# Altium project ((Inventory)).PrjPcb (part 4 of 4)

## Sheet Connector.SchDoc
size A3; SheetNumber: 16; SheetTotal: 26
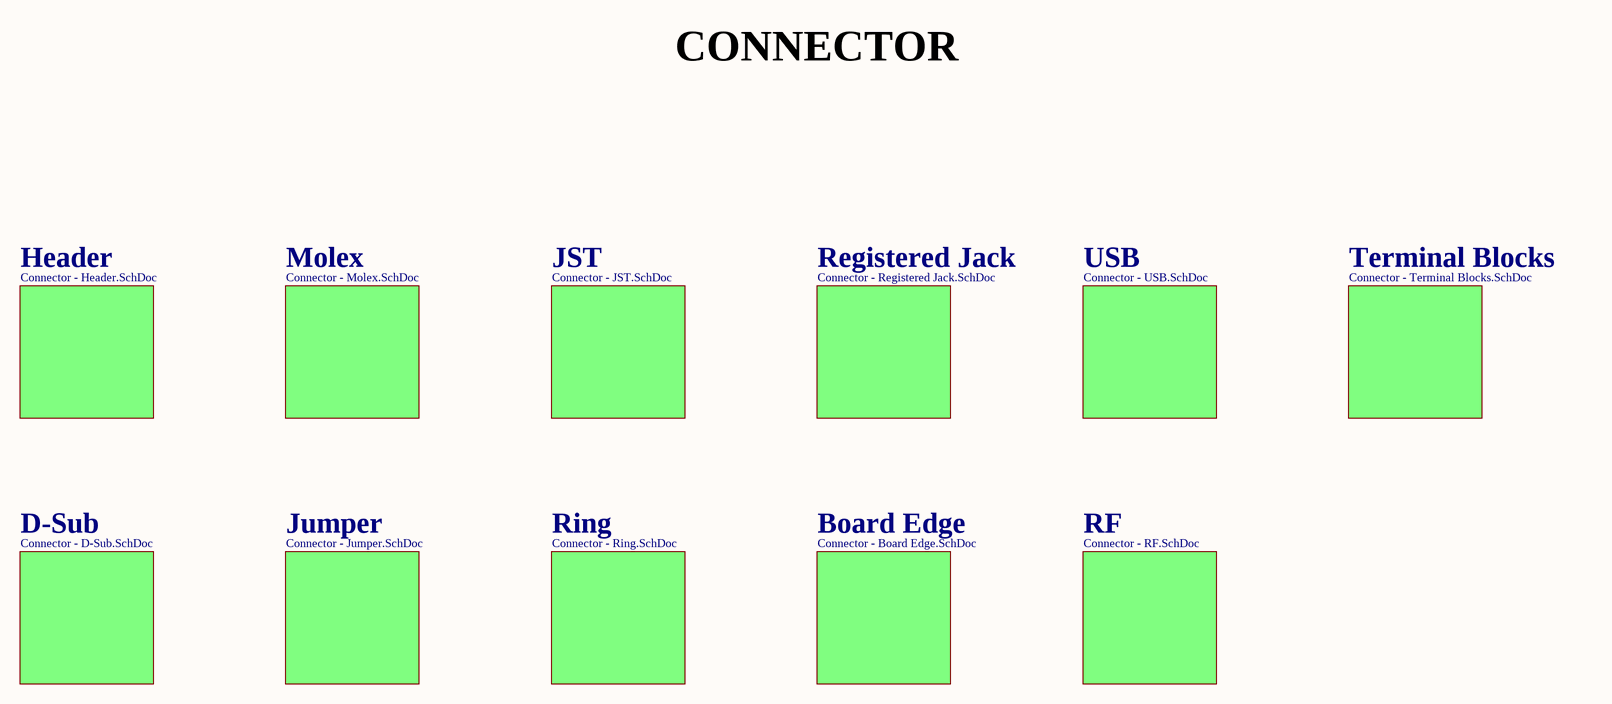
[diagram p64: Connector.SchDoc]

### Sub-sheets
Board Edge = Connector - Board Edge.SchDoc (file not in this document): no entries
D-Sub = Connector - D-Sub.SchDoc (file not in this document): no entries
Header = Connector - Header.SchDoc: no entries
JST = Connector - JST.SchDoc: no entries
Jumper = Connector - Jumper.SchDoc (file not in this document): no entries
Molex = Connector - Molex.SchDoc (file not in this document): no entries
Registered Jack = Connector - Registered Jack.SchDoc: no entries
RF = Connector - RF.SchDoc (file not in this document): no entries
Ring = Connector - Ring.SchDoc (file not in this document): no entries
Terminal Blocks = Connector - Terminal Blocks.SchDoc (file not in this document): no entries
USB = Connector - USB.SchDoc: no entries

### Notes on the sheet
- CONNECTOR

## Sheet Connector - Header.SchDoc
size A4; SheetNumber: 17; SheetTotal: 28
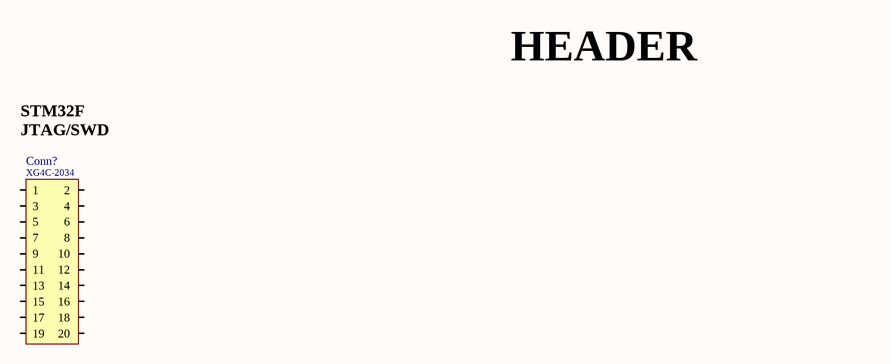
[diagram p65: Connector - Header.SchDoc]

### Parts
(Parts that share a designator on the sheet are numbered #1, #2 ... from top to bottom, then left to right.)
Conn?#1  Manufacturer Part Number: XG4C-2034  [Connector - Omron, XG4C-2034]  (hidden comment: Connector - 20P)

### Nets

Not connected (* = marked no-connect by the designer): Conn?#1 1 2 3 4 5 6 7 8 9 10 11 12 13 14 15 16 17 18 19 20

### Notes on the sheet
- HEADER
- (near Conn?#1) STM32F
  JTAG/SWD

### Library data of the parts
Conn?#1 = Connector - 20P: Conn, Header, 20P, RA, TH, Shrouded; Manufacturer: Omron; ComponentLink1Description: Datasheet; ComponentLink1URL: E:\Altium\Datasheets\Connector - Header\Connector - Omron, XG4 Series.pdf; ComponentLink2Description: Supplier Link; ComponentLink2URL: https://www.digikey.com/en/products/detail/omron-electronics-inc-emc-div/XG4C-2034/1787182; Supplier: Digikey; Supplier Part Number: OR900-ND; Operating Temperature, Min: -55℃; Operating Temperature, Max: +105℃; Quantity, Min: 1; Quantity, Max: 450; Price, Min: 1.97; Supplier Currency: $; Price, Max: 1.27716; Supplier Link: https://www.digikey.com/en/products/detail/omron-electronics-inc-emc-div/XG4C-2034/1787182; Component Type: Header; Component Category: Connector; Package: TH, RA, Shrouded

## Sheet Connector - JST.SchDoc
size A3; SheetNumber: 18; SheetTotal: 41
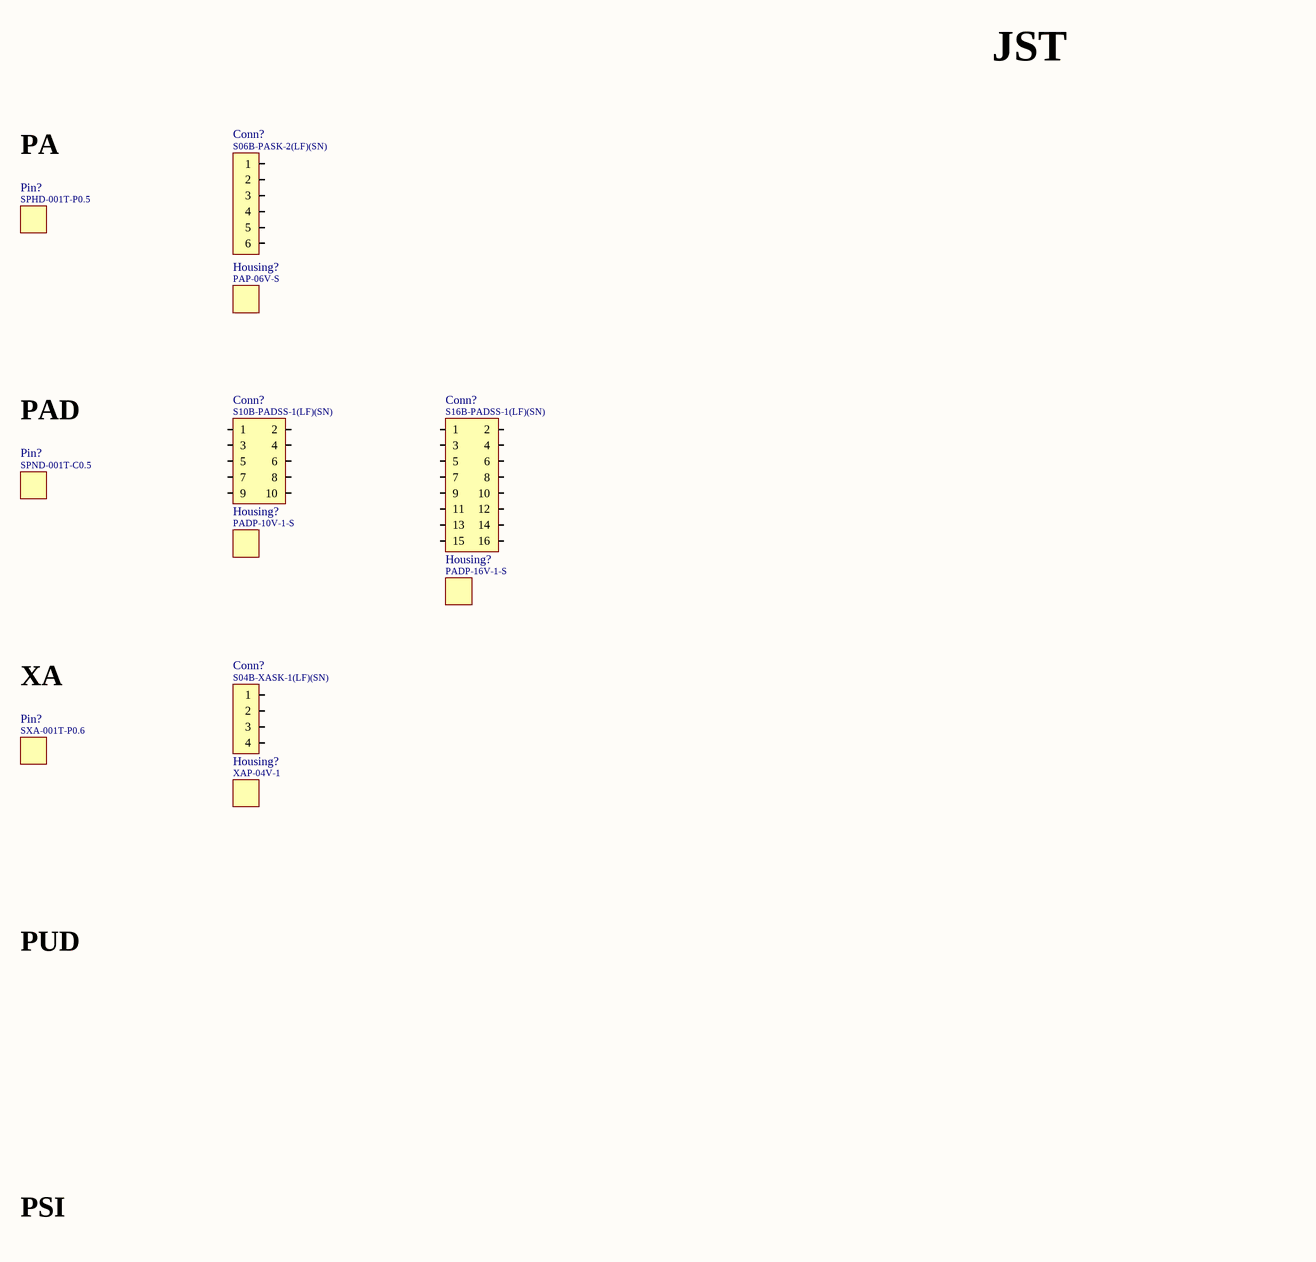
[diagram p66: Connector - JST.SchDoc]

### Parts
(Parts that share a designator on the sheet are numbered #1, #2 ... from top to bottom, then left to right.)
Conn?#2  Manufacturer Part Number: S06B-PASK-2(LF)(SN)  [Connector, S06B-PASK-2]  (hidden comment: Connector - 6P)
Conn?#3  Manufacturer Part Number: S10B-PADSS-1(LF)(SN)  [Connector, S10B-PADSS-1]  (hidden comment: Connector - 10P)
Conn?#4  Manufacturer Part Number: S16B-PADSS-1(LF)(SN)  [Connector, S16B-PADSS-1]  (hidden comment: Connector - 16P)
Conn?#5  Manufacturer Part Number: S04B-XASK-1(LF)(SN)  [Connector, S04B-XASK-1]  (hidden comment: Connector - 4P)
Housing?#1  Manufacturer Part Number: PAP-06V-S  [Housing, PAP-06V-S]  (hidden comment: Housing)
Housing?#2  Manufacturer Part Number: PADP-10V-1-S  [Housing, PADP-10V-1-S]  (hidden comment: Housing)
Housing?#3  Manufacturer Part Number: PADP-16V-1-S  [Housing, PADP-16V-1-S]  (hidden comment: Housing)
Housing?#4  Manufacturer Part Number: XAP-04V-1  [Housing, PAP-06V-S]  (hidden comment: Housing)
Pin?#1  Manufacturer Part Number: SPHD-001T-P0.5  [Pin, SPHD-001T-P0.5]  (hidden comment: Pin)
Pin?#2  Manufacturer Part Number: SPND-001T-C0.5  [Pin, SPND-001T-C0.5]  (hidden comment: Pin)
Pin?#3  Manufacturer Part Number: SXA-001T-P0.6  [Pin, SPHD-001T-P0.5]  (hidden comment: Pin)

### Nets

Not connected (* = marked no-connect by the designer): Conn?#2 1 2 3 4 5 6; Conn?#3 1 2 3 4 5 6 7 8 9 10; Conn?#4 1 2 3 4 5 6 7 8 9 10 11 12 13 14 15 16; Conn?#5 1 2 3 4

### Notes on the sheet
- JST
- (near Pin?#1) PA
- (near Pin?#2) PAD
- (near Pin?#3) XA
- PUD
- PSI

### Library data of the parts
Conn?#2 = Connector - 6P: Conn, JST, 6P, TH, PA, Side Entry; ComponentLink1Description: Datasheet; ComponentLink1URL: E:\Altium\Datasheets\Connector - JST\PA Family.pdf; ComponentLink2Description: Supplier Link; ComponentLink2URL: https://www.digikey.com/en/products/detail/jst-sales-america-inc/S06B-PASK-2-LF-SN/926757; Supplier: Digikey; Supplier Part Number: 455-1851-ND; Manufacturer: JST; Operating Temperature, Min: -25℃; Operating Temperature, Max: +85℃; Quantity, Min: 1; Quantity, Max: 10000; Price, Min: 0.51; Supplier Currency: $; Price, Max: 0.21423; Supplier Link: https://www.digikey.com/en/products/detail/jst-sales-america-inc/S06B-PASK-2-LF-SN/926757; Component Type: PCB; Component Category: Connector; Package: TH, Side
Conn?#3 = Connector - 10P: Conn, JST, 10P, TH, PAD, Side Entry; ComponentLink1Description: Datasheet; ComponentLink1URL: E:\Altium\Datasheets\Connector - JST\PAD Family.pdf; ComponentLink2Description: Supplier Link; ComponentLink2URL: https://www.digikey.com/en/products/detail/jst-sales-america-inc/S10B-PADSS-1-LF-SN/1634773; Supplier: Digikey; Supplier Part Number: 455-2032-ND; Manufacturer: JST; Operating Temperature, Min: -25℃; Operating Temperature, Max: +85℃; Quantity, Min: 1; Quantity, Max: 10080; Price, Min: 0.65; Supplier Currency: $; Price, Max: 0.27565; Supplier Link: https://www.digikey.com/en/products/detail/jst-sales-america-inc/S10B-PADSS-1-LF-SN/1634773; Component Type: PCB; Component Category: Connector; Package: TH, 2 Rows, RA, Side Entry
Conn?#4 = Connector - 16P: Conn, JST, 16P, TH, PAD, Side Entry; ComponentLink1Description: Datasheet; ComponentLink1URL: E:\Altium\Datasheets\Connector - JST\PAD Family.pdf; ComponentLink2Description: Supplier Link; ComponentLink2URL: https://www.digikey.com/en/products/detail/jst-sales-america-inc/S16B-PADSS-1-LF-SN/1634778; Supplier: Digikey; Supplier Part Number: 455-2037-ND; Manufacturer: JST; Operating Temperature, Min: -25℃; Operating Temperature, Max: +85℃; Quantity, Min: 1; Quantity, Max: 10080; Price, Min: 0.77; Supplier Currency: $; Price, Max: 0.35386; Supplier Link: https://www.digikey.com/en/products/detail/jst-sales-america-inc/S16B-PADSS-1-LF-SN/1634778; Component Type: PCB; Component Category: Connector; Package: TH, 2 Rows, RA, Side Entry
Conn?#5 = Connector - 4P: Conn, JST, 4P, TH, XA, Side Entry; ComponentLink1Description: Datasheet; ComponentLink1URL: E:\Altium\Datasheets\Connector - JST\XA Family.pdf; ComponentLink2Description: Supplier Link; ComponentLink2URL: https://www.digikey.com/en/products/detail/jst-sales-america-inc/S04B-XASK-1-LF-SN/7230506; Supplier: Digikey; Supplier Part Number: 455-4090-ND; Manufacturer: JST; Operating Temperature, Min: -25℃; Operating Temperature, Max: +85℃; Quantity, Min: 1; Quantity, Max: 10000; Price, Min: 0.53; Supplier Currency: $; Price, Max: 0.22547; Supplier Link: https://www.digikey.com/en/products/detail/jst-sales-america-inc/S04B-XASK-1-LF-SN/7230506; Component Type: PCB; Component Category: Connector; Package: SMD, TH, Side Entry
Housing?#1 = Housing: Housing, JST, PAP-06V-S; Component Category: Connector; ComponentLink1Description: Datasheet; ComponentLink1URL: E:\Altium\Datasheets\Connector - JST\PA Family.pdf; ComponentLink2Description: Supplier Link; ComponentLink2URL: https://www.digikey.com/en/products/detail/jst-sales-america-inc/PAP-06V-S/759978; Supplier: Digikey; Supplier Part Number: 455-1490-ND; Manufacturer: JST; Operating Temperature, Min: -25℃; Operating Temperature, Max: +85℃; Quantity, Min: 1; Quantity, Max: 2500; Price, Min: 0.19; Supplier Currency: $; Price, Max: 0.07808; Supplier Link: https://www.digikey.com/en/products/detail/jst-sales-america-inc/PAP-06V-S/759978; Component Type: PCB; Package: Housing
Housing?#2 = Housing: Housing, JST, 10P, PAD; Component Category: Connector; ComponentLink1Description: Datasheet; ComponentLink1URL: E:\Altium\Datasheets\Connector - JST\PAD Family.pdf; ComponentLink2Description: Supplier Link; ComponentLink2URL: https://www.digikey.com/en/products/detail/jst-sales-america-inc/PADP-10V-1-S/1300221; Supplier: Digikey; Supplier Part Number: 455-2140-ND; Manufacturer: JST; Operating Temperature, Min: -25℃; Operating Temperature, Max: +85℃; Quantity, Min: 1; Quantity, Max: 2500; Price, Min: 0.33; Supplier Currency: $; Price, Max: 0.14264; Supplier Link: https://www.digikey.com/en/products/detail/jst-sales-america-inc/PADP-10V-1-S/1300221; Component Type: PCB; Package: Housing
Housing?#3 = Housing: Housing, JST, 16P, PAD; Component Category: Connector; ComponentLink1Description: Datasheet; ComponentLink1URL: E:\Altium\Datasheets\Connector - JST\PAD Family.pdf; ComponentLink2Description: Supplier Link; ComponentLink2URL: https://www.digikey.com/en/products/detail/jst-sales-america-inc/PADP-16V-1-S/1300224; Supplier: Digikey; Supplier Part Number: 455-2143-ND; Manufacturer: JST; Operating Temperature, Min: -25℃; Operating Temperature, Max: +85℃; Quantity, Min: 1; Quantity, Max: 2500; Price, Min: 0.35; Supplier Currency: $; Price, Max: 0.152; Supplier Link: https://www.digikey.com/en/products/detail/jst-sales-america-inc/PADP-16V-1-S/1300224?s=N4IgTCBcDaIAoEEAicC0BGAbANQyAugL5A; Component Type: PCB; Package: Housing
Housing?#4 = Housing: Housing, JST, 4P, XA; Component Category: Connector; ComponentLink1Description: Datasheet; ComponentLink1URL: E:\Altium\Datasheets\Connector - JST\XA Family.pdf; ComponentLink2Description: Supplier Link; ComponentLink2URL: https://www.digikey.com/en/products/detail/jst-sales-america-inc/XAP-04V-1/959010; Supplier: Digikey; Supplier Part Number: 455-2150-ND; Manufacturer: JST; Operating Temperature, Min: -25℃; Operating Temperature, Max: +85℃; Quantity, Min: 1; Quantity, Max: 2500; Price, Min: 0.16; Supplier Currency: $; Price, Max: 0.05958; Supplier Link: https://www.digikey.com/en/products/detail/jst-sales-america-inc/XAP-04V-1/959010; Component Type: Housing; Package: Housing
Pin?#1 = Pin: Pin, JST, SPHD-001T-P0.5; Component Category: Connector; ComponentLink1Description: Datasheet; ComponentLink1URL: E:\Altium\Datasheets\Connector - JST\PA Family.pdf; ComponentLink2Description: Supplier Link; ComponentLink2URL: https://www.digikey.com/en/products/detail/jst-sales-america-inc/SPHD-001T-P0-5/608766; Supplier: Digikey; Supplier Part Number: 455-1325-1-ND; Manufacturer: JST; Operating Temperature, Min: *℃; Operating Temperature, Max: *℃; Quantity, Min: 1; Quantity, Max: 2500; Price, Min: 0.1; Supplier Currency: $; Price, Max: 0.01478; Supplier Link: https://www.digikey.com/en/products/detail/jst-sales-america-inc/SPHD-001T-P0-5/608766; Component Type: PCB; Package: Housing
Pin?#2 = Pin: Pin, JST, SPND-001T-C0.5; Component Category: Connector; ComponentLink1Description: Datasheet; ComponentLink1URL: E:\Altium\Datasheets\Connector - JST\PAD Family.pdf; ComponentLink2Description: Supplier Link; ComponentLink2URL: https://www.digikey.com/en/products/detail/jst-sales-america-inc/SPND-001T-C0-5/1788519; Supplier: Digikey; Supplier Part Number: 455-2303-1-ND; Manufacturer: JST; Operating Temperature, Min: ---℃; Operating Temperature, Max: ---℃; Quantity, Min: 1; Quantity, Max: 56000; Price, Min: 0.1; Supplier Currency: $; Price, Max: 0.01409; Supplier Link: https://www.digikey.com/en/products/detail/jst-sales-america-inc/SPND-001T-C0-5/1788519; Component Type: PCB; Package: Housing
Pin?#3 = Pin: Pin, JST, SXA-001T-P0.6; Component Category: Connector; ComponentLink1Description: Datasheet; ComponentLink1URL: E:\Altium\Datasheets\Connector - JST\XA Family.pdf; ComponentLink2Description: Supplier Link; ComponentLink2URL: https://www.digikey.com/en/products/detail/jst-sales-america-inc/SXA-001T-P0-6/923775; Supplier: Digikey; Supplier Part Number: 455-1904-1-ND; Manufacturer: JST; Operating Temperature, Min: ---℃; Operating Temperature, Max: ---℃; Quantity, Min: 1; Quantity, Max: 56000; Price, Min: 0.1; Supplier Currency: $; Price, Max: 0.01303; Supplier Link: https://www.digikey.com/en/products/detail/jst-sales-america-inc/SXA-001T-P0-6/923775; Component Type: Pin; Package: Housing

## Sheet Connector - Registered Jack.SchDoc
size A4; SheetNumber: 19; SheetTotal: 41
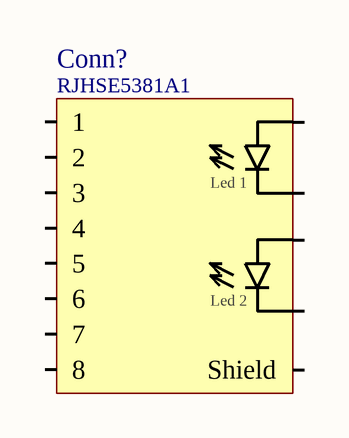
[diagram p67: Connector - Registered Jack.SchDoc]

### Parts
(Parts that share a designator on the sheet are numbered #1, #2 ... from top to bottom, then left to right.)
Conn?#6  Manufacturer Part Number: RJHSE5381A1  [RJ45 - Amphenol, RJHSE-x38x-A1]  (hidden comment: RJ45 - Amphenol, RJHSE-x38x-A1)

### Nets

Not connected (* = marked no-connect by the designer): Conn?#6 1 2 3 4 5 6 7 8 L1-A L1-C L2-A L2-C Shield

### Notes on the sheet
- (in symbol RJ45 - Amphenol, RJHSE-x38x-A1) Led 1; Led 2

### Library data of the parts
Conn?#6 = RJ45 - Amphenol, RJHSE-x38x-A1: Conn, RJ45, 2 Leds, Shielded, Side Entry; Component Category: Connector; ComponentLink1Description: Datasheet; ComponentLink1URL: E:\Altium\Datasheets\Connector - Registered Jack\RJ45 - Amphenol, RJHSE-x38x-A1.pdf; ComponentLink2Description: Supplier Link; ComponentLink2URL: https://www.digikey.com/en/products/detail/amphenol-cs-commercial-products/RJHSE5381A1/3083556; Supplier: Digikey; Supplier Part Number: RJHSE5381A1-ND; Manufacturer: Amphenol; Operating Temperature, Min: -55℃; Operating Temperature, Max: +85℃; Quantity, Min: 1; Quantity, Max: 2400; Price, Min: 1.51; Supplier Currency: $; Price, Max: 0.806; Supplier Link: https://www.digikey.com/en/products/detail/amphenol-cs-commercial-products/RJHSE5381A1/3083556; Component Type: PCB; Package: RJ45

## Sheet Connector - USB.SchDoc
size A4; SheetNumber: 35; SheetTotal: 35
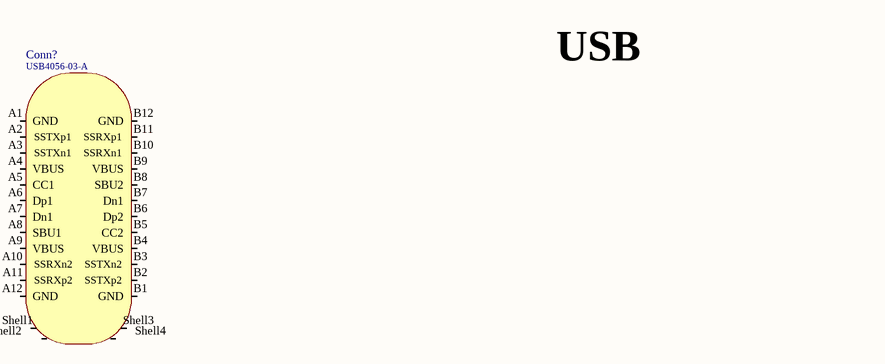
[diagram p68: Connector - USB.SchDoc]

### Parts
(Parts that share a designator on the sheet are numbered #1, #2 ... from top to bottom, then left to right.)
Conn?#7  Manufacturer Part Number: USB4056-03-A  [GCT, USB4056]  (hidden comment: GCT, USB4056)

### Nets

Not connected (* = marked no-connect by the designer): Conn?#7 A1(GND) A2(SSTXp1) A3(SSTXn1) A4(VBUS) A5(CC1) A6(Dp1) A7(Dn1) A8(SBU1) A9(VBUS) A10(SSRXn2) A11(SSRXp2) A12(GND) B1(GND) B2(SSTXp2) B3(SSTXn2) B4(VBUS) B5(CC2) B6(Dp2) B7(Dn1) B8(SBU2) B9(VBUS) B10(SSRXn1) B11(SSRXp1) B12(GND) Shell1(Chassis1) Shell2(Chassis2) Shell3(Chassis3) Shell4(Chassis4)

### Notes on the sheet
- USB

### Library data of the parts
Conn?#7 = GCT, USB4056: Conn, USB, TYPE-C; Component Category: Connector; ComponentLink1Description: Datasheet; ComponentLink1URL: E:\Altium\Datasheets\Connector - USB\GCT, USB4056.pdf; ComponentLink2Description: Supplier Link; ComponentLink2URL: https://www.digikey.com/en/products/detail/gct/USB4056-03-A/14638038; Supplier: Digikey; Supplier Part Number: 2073-USB4056-03-ACT-ND; Manufacturer: GCT; Operating Temperature, Min: -25℃; Operating Temperature, Max: +85℃; Quantity, Min: 1; Quantity, Max: 10000; Price, Min: 0.97; Supplier Currency: $; Price, Max: 0.44463; Supplier Link: https://www.digikey.com/en/products/detail/gct/USB4056-03-A/14638038; Component Type: USB; Package: TH+SMT, Side

## Sheet Transistor - BJT.SchDoc
size A3; SheetNumber: 39; SheetTotal: 39
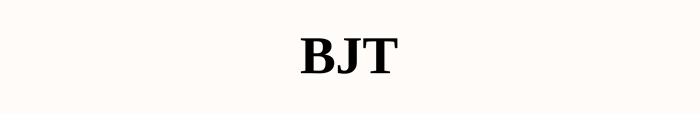
[diagram p69: Transistor - BJT.SchDoc]

### Notes on the sheet
- BJT

## Sheet Transformer.SchDoc
size A3; SheetNumber: 39; SheetTotal: 41
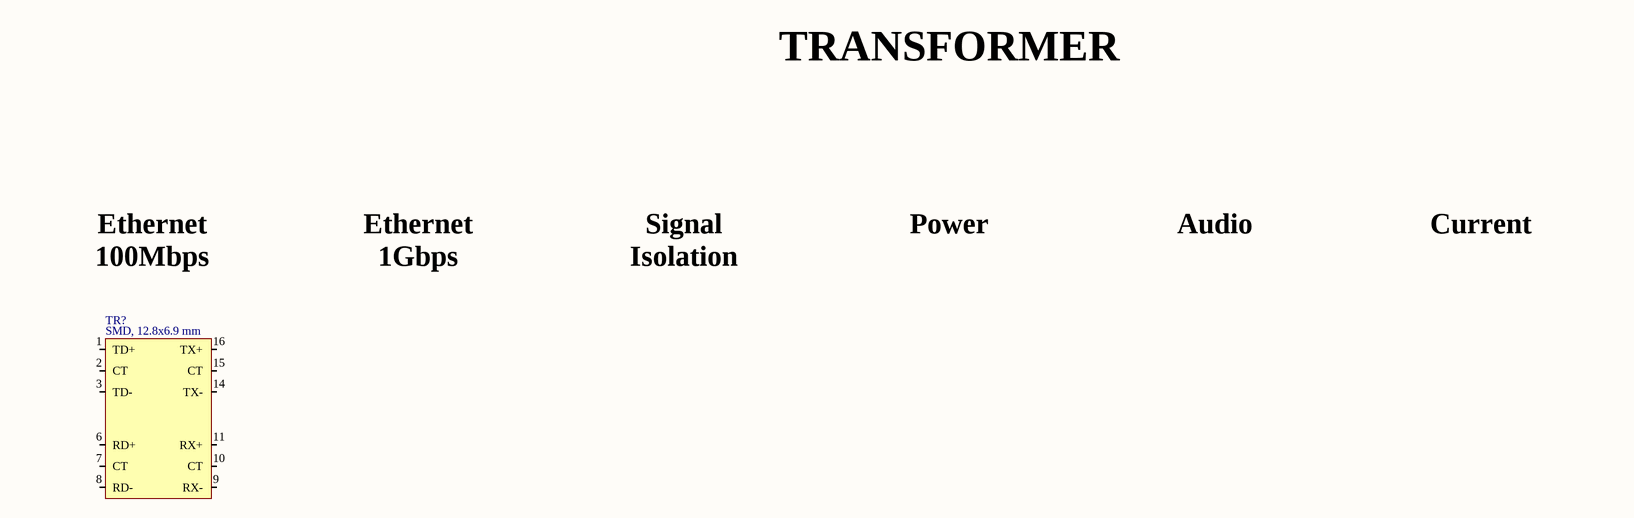
[diagram p70: Transformer.SchDoc]

### Parts
TR?  Package: SMD, 12.8x6.9 mm  [Transformer, Pulse - Bourns, SM13126PEL]  (hidden comment: Transformer, Pulse - Bourns, SM13126PEL)

### Nets

Not connected (* = marked no-connect by the designer): TR? 1(TD+) 2(CT) 3(TD-) 6(RD+) 7(CT) 8(RD-) 9(RX-) 10(CT) 11(RX+) 14(TX-) 15(CT) 16(TX+)

### Notes on the sheet
- TRANSFORMER
- Ethernet
  100Mbps
- Ethernet
  1Gbps
- Signal
  Isolation
- Power
- Audio
- Current

### Library data of the parts
TR? = Transformer, Pulse - Bourns, SM13126PEL: Transformer, Eth, 100Mbps, SM13126PEL; ComponentLink1Description: Datasheet; ComponentLink1URL: E:\Altium\Datasheets\Transformer\Transformer, Pulse - Bourns, SM51108PEL.pdf; ComponentLink2Description: Supplier Link; ComponentLink2URL: https://www.digikey.com/en/products/detail/bourns-inc/SM13126PEL/10229989; Manufacturer Part Number: SM13126PEL; Supplier: Digikey; Supplier Part Number: SM13126PELCT-ND; Manufacturer: Bourns; Operating Temperature, Min: -40℃; Operating Temperature, Max: +85℃; Quantity, Min: 1; Quantity, Max: 6000; Price, Min: 2.17; Price, Max: 1.05049; Supplier Currency: $; Supplier Link: https://www.digikey.com/en/products/detail/bourns-inc/SM13126PEL/10229989; Component Type: Pulse; Component Category: Transformer

## Sheet IC - Interface.SchDoc
size A4; SheetNumber: 32; SheetTotal: 41
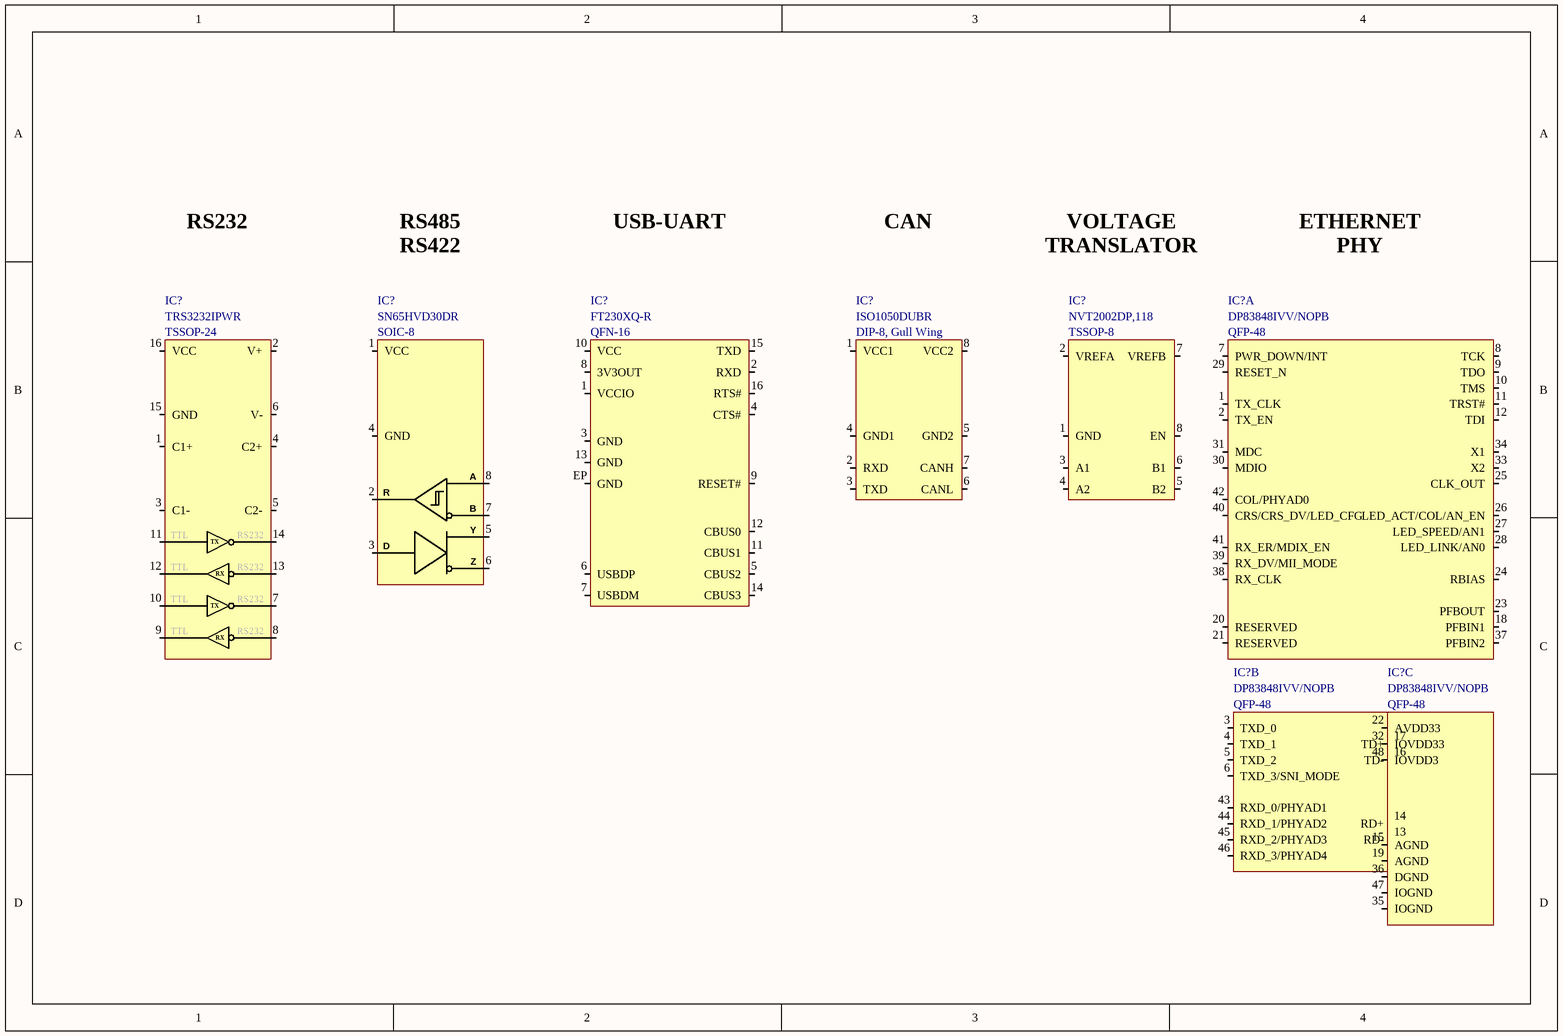
[diagram p71: IC - Interface.SchDoc]

### Parts
(Parts that share a designator on the sheet are numbered #1, #2 ... from top to bottom, then left to right.)
IC?#1  Manufacturer Part Number: TRS3232IPWR  Package: TSSOP-24  [TSSOP-16]  (hidden comment: RS232 - Texas, TRS3232IPWR)
IC?#2  Manufacturer Part Number: SN65HVD30DR  Package: SOIC-8  [SOIC-8, NB]  (hidden comment: RS422 - Texas, SN65HVD30D)
IC?#3  Manufacturer Part Number: FT230XQ-R  Package: QFN-16  [QFN-16, 4mm x 4mm, 0.65mm]  (hidden comment: FTDI, FT230XQ)
IC?#4  Manufacturer Part Number: ISO1050DUBR  [DIP-8, Gull Wing]  (hidden comment: CAN - Texas, ISO1050DUB)
IC?#5  Manufacturer Part Number: NVT2002DP,118  Package: TSSOP-8  [TSSOP-8, Body 3mm, Pitch 0.65mm]  (hidden comment: Voltage Translator, I2C - Nxp, NVT2002DP)
IC?#6  Manufacturer Part Number: DP83848IVV/NOPB  Package: QFP-48  [QFP-48, 7mm x 7mm, 0.5mm]  (hidden comment: Ethernet - Texas, DP83848xVV)  (part A of 3)
IC?#7  Manufacturer Part Number: DP83848IVV/NOPB  Package: QFP-48  [QFP-48, 7mm x 7mm, 0.5mm]  (hidden comment: Ethernet - Texas, DP83848xVV)  (part B of 3)
IC?#8  Manufacturer Part Number: DP83848IVV/NOPB  Package: QFP-48  [QFP-48, 7mm x 7mm, 0.5mm]  (hidden comment: Ethernet - Texas, DP83848xVV)  (part C of 3)

### Nets

Not connected (* = marked no-connect by the designer): IC?#1 1(C1+) 2(V+) 3(C1-) 4(C2+) 5(C2-) 6(V-) 7(DOUT2) 8(RIN2) 9(ROUT2) 10(DIN2) 11(DIN1) 12(ROUT1) 13(RIN1) 14(DOUT1) 15(GND) 16(VCC); IC?#2 1(VCC) 2(R) 3(D) 4(GND) 5(Y) 6(Z) 7(B) 8(A); IC?#3 1(VCCIO) 2(RXD) 3(GND) 4(CTS#) 5(CBUS2) 6(USBDP) 7(USBDM) 8(3V3OUT) 9(RESET#) 10(VCC) 11(CBUS1) 12(CBUS0) 13(GND) 14(CBUS3) 15(TXD) 16(RTS#) EP(GND); IC?#4 1(VCC1) 2(RXD) 3(TXD) 4(GND1) 5(GND2) 6(CANL) 7(CANH) 8(VCC2); IC?#5 1(GND) 2(VREFA) 3(A1) 4(A2) 5(B2) 6(B1) 7(VREFB) 8(EN); IC?#6 1(TX_CLK) 2(TX_EN) 7(PWR_DOWN/INT) 8(TCK) 9(TDO) 10(TMS) 11(TRST#) 12(TDI) 18(PFBIN1) 20(RESERVED) 21(RESERVED) 23(PFBOUT) 24(RBIAS) 25(CLK_OUT) 26(LED_ACT/COL/AN_EN) 27(LED_SPEED/AN1) 28(LED_LINK/AN0) 29(RESET_N) 30(MDIO) 31(MDC) 33(X2) 34(X1) 37(PFBIN2) 38(RX_CLK) 39(RX_DV/MII_MODE) 40(CRS/CRS_DV/LED_CFG) 41(RX_ER/MDIX_EN) 42(COL/PHYAD0); IC?#7 3(TXD_0) 4(TXD_1) 5(TXD_2) 6(TXD_3/SNI_MODE) 13(RD-) 14(RD+) 16(TD-) 17(TD+) 43(RXD_0/PHYAD1) 44(RXD_1/PHYAD2) 45(RXD_2/PHYAD3) 46(RXD_3/PHYAD4); IC?#8 15(AGND) 19(AGND) 22(AVDD33) 32(IOVDD33) 35(IOGND) 36(DGND) 47(IOGND) 48(IOVDD3)

### Notes on the sheet
- RS232
- RS485
  RS422
- USB-UART
- CAN
- VOLTAGE
  TRANSLATOR
- ETHERNET
  PHY
- (in symbol RS232 - Texas, TRS3232IPWR) TTL; TX; RS232; RX

### Library data of the parts
IC?#1 = RS232 - Texas, TRS3232IPWR: IC, Interface, RS232, TSSOP-24; ComponentLink1Description: Datasheet; ComponentLink1URL: E:\Altium\Datasheets\IC - Interface\RS232 - Texas, TRS3232.pdf; ComponentLink2Description: Supplier Link; ComponentLink2URL: https://www.digikey.com/en/products/detail/texas-instruments/TRS3232IPWR/1909117; Supplier: Digikey; Supplier Part Number: 296-24818-1-ND; Manufacturer: Texas; Operating Temperature, Min: -55℃; Operating Temperature, Max: +85℃; Quantity, Min: 1; Quantity, Max: 2000; Price, Min: 1.95; Supplier Currency: $; Price, Max: 0.9984; Supplier Link: https://www.digikey.com/en/products/detail/texas-instruments/TRS3232IPWR/1909117; Component Type: Interface; Component Category: IC
IC?#2 = RS422 - Texas, SN65HVD30D: IC, Interface, RS422, SOIC-8; ComponentLink1Description: Datasheet; ComponentLink1URL: E:\Altium\Datasheets\IC - Interface\RS422 - Texas, SN65HVD3x.pdf; ComponentLink2Description: Supplier Link; ComponentLink2URL: https://www.digikey.com/en/products/detail/texas-instruments/SN65HVD30DR/1016459; Supplier: Digikey; Supplier Part Number: 296-19625-1-ND; Manufacturer: Texas; Operating Temperature, Min: -55℃; Operating Temperature, Max: +85℃; Quantity, Min: 1; Quantity, Max: 2500; Price, Min: 4.32; Supplier Currency: $; Price, Max: 2.16943; Supplier Link: https://www.digikey.com/en/products/detail/texas-instruments/SN65HVD30DR/1016459; Component Type: Interface; Component Category: IC
IC?#3 = FTDI, FT230XQ: IC, Interface, FTDI, QFN-16; ComponentLink1Description: Datasheet; ComponentLink1URL: E:\Altium\Datasheets\IC - Interface\FTDI, FT230X.pdf; ComponentLink2Description: Supplier Link; ComponentLink2URL: https://www.digikey.com/en/products/detail/ftdi-future-technology-devices-international-ltd/FT230XQ-R/3029142; Supplier: Digikey; Supplier Part Number: 768-1130-1-ND; Manufacturer: FTDI; Operating Temperature, Min: -40℃; Operating Temperature, Max: +85℃; Quantity, Min: 1; Quantity, Max: 5000; Price, Min: 2.14; Supplier Currency: $; Price, Max: 1.7125; Supplier Link: https://www.digikey.com/en/products/detail/ftdi-future-technology-devices-international-ltd/FT230XQ-R/3029142; Component Type: Interface; Component Category: IC
IC?#4 = CAN - Texas, ISO1050DUB: IC, Interface, CAN, DIP-8, Gull Wing; ComponentLink1Description: Datasheet; ComponentLink1URL: E:\Altium\Datasheets\IC - Interface\CAN - Texas, ISO1050.pdf; ComponentLink2Description: Supplier Link; ComponentLink2URL: https://www.digikey.com/en/products/detail/texas-instruments/ISO1050DUBR/2094633; Supplier: Digikey; Supplier Part Number: 296-24818-1-ND; Manufacturer: Texas; Operating Temperature, Min: -55℃; Operating Temperature, Max: +105℃; Quantity, Min: 1; Quantity, Max: 1050; Price, Min: 5.71; Supplier Currency: $; Price, Max: 3.25280; Supplier Link: https://www.digikey.com/en/products/detail/texas-instruments/ISO1050DUBR/2094633; Component Type: Interface; Component Category: IC; Package: DIP-8, Gull Wing
IC?#5 = Voltage Translator, I2C - Nxp, NVT2002DP: IC, Interface, I2C, TSSOP-8; ComponentLink1Description: Datasheet; ComponentLink1URL: E:\Altium\Datasheets\IC - Interface\Voltage Translator, I2C - Nxp, NVT2001, NVT2002.pdf; ComponentLink2Description: Supplier Link; ComponentLink2URL: https://www.digikey.com/en/products/detail/nxp-usa-inc/NVT2002DP-118/2355938; Supplier: Digikey; Supplier Part Number: 568-5121-1-ND; Manufacturer: Nxp; Operating Temperature, Min: -40℃; Operating Temperature, Max: +85℃; Quantity, Min: 1; Quantity, Max: 5000; Price, Min: 0.94; Supplier Currency: $; Price, Max: 0.35985; Supplier Link: https://www.digikey.com/en/products/detail/nxp-usa-inc/NVT2002DP-118/2355938; Component Type: Interface; Component Category: IC
IC?#6-IC?#8 = Ethernet - Texas, DP83848xVV: IC, Interface, Eth Phy, 10/100Mb, DP83848IVV; ComponentLink1Description: Datasheet; ComponentLink1URL: E:\Altium\Datasheets\IC - Interface\Ethernet - Texas, DP83848.pdf; ComponentLink2Description: Supplier Link; ComponentLink2URL: https://www.digikey.com/en/products/detail/texas-instruments/DP83848IVV-NOPB/947543; Supplier: Digikey; Supplier Part Number: DP83848IVV/NOPB-ND; Manufacturer: Texas; Operating Temperature, Min: -40℃; Operating Temperature, Max: +85℃; Quantity, Min: 1; Quantity, Max: 1000; Price, Min: 6.45; Supplier Currency: $; Price, Max: 3.834; Supplier Link: https://www.digikey.com/en/products/detail/texas-instruments/DP83848IVV-NOPB/947543; Component Type: Interface; Component Category: IC

## Sheet IC - MCU.SchDoc
size A4; SheetNumber: 21; SheetTotal: 21
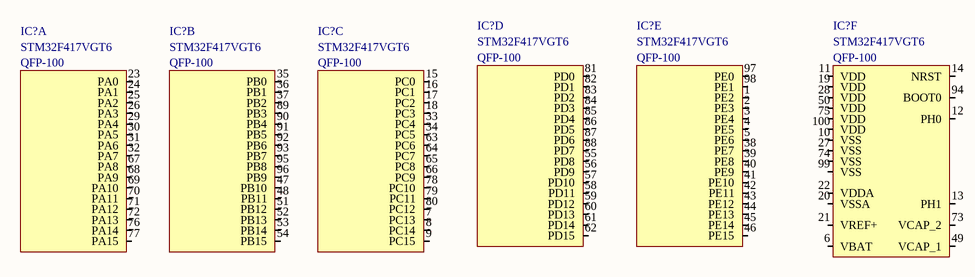
[diagram p72: IC - MCU.SchDoc]

### Parts
(Parts that share a designator on the sheet are numbered #1, #2 ... from top to bottom, then left to right.)
IC?#9  Manufacturer Part Number: STM32F417VGT6  Package: QFP-100  [QFP-100, 14mm x 14mm, 0.5mm]  (hidden comment: STM, STM32F417VxTx)  (part A of 6)
IC?#10  Manufacturer Part Number: STM32F417VGT6  Package: QFP-100  [QFP-100, 14mm x 14mm, 0.5mm]  (hidden comment: STM, STM32F417VxTx)  (part B of 6)
IC?#11  Manufacturer Part Number: STM32F417VGT6  Package: QFP-100  [QFP-100, 14mm x 14mm, 0.5mm]  (hidden comment: STM, STM32F417VxTx)  (part C of 6)
IC?#12  Manufacturer Part Number: STM32F417VGT6  Package: QFP-100  [QFP-100, 14mm x 14mm, 0.5mm]  (hidden comment: STM, STM32F417VxTx)  (part D of 6)
IC?#13  Manufacturer Part Number: STM32F417VGT6  Package: QFP-100  [QFP-100, 14mm x 14mm, 0.5mm]  (hidden comment: STM, STM32F417VxTx)  (part E of 6)
IC?#14  Manufacturer Part Number: STM32F417VGT6  Package: QFP-100  [QFP-100, 14mm x 14mm, 0.5mm]  (hidden comment: STM, STM32F417VxTx)  (part F of 6)

### Nets

Not connected (* = marked no-connect by the designer): IC?#9 23(PA0) 24(PA1) 25(PA2) 26(PA3) 29(PA4) 30(PA5) 31(PA6) 32(PA7) 67(PA8) 68(PA9) 69(PA10) 70(PA11) 71(PA12) 72(PA13) 76(PA14) 77(PA15); IC?#10 35(PB0) 36(PB1) 37(PB2) 47(PB10) 48(PB11) 51(PB12) 52(PB13) 53(PB14) 54(PB15) 89(PB3) 90(PB4) 91(PB5) 92(PB6) 93(PB7) 95(PB8) 96(PB9); IC?#11 7(PC13) 8(PC14) 9(PC15) 15(PC0) 16(PC1) 17(PC2) 18(PC3) 33(PC4) 34(PC5) 63(PC6) 64(PC7) 65(PC8) 66(PC9) 78(PC10) 79(PC11) 80(PC12); IC?#12 55(PD8) 56(PD9) 57(PD10) 58(PD11) 59(PD12) 60(PD13) 61(PD14) 62(PD15) 81(PD0) 82(PD1) 83(PD2) 84(PD3) 85(PD4) 86(PD5) 87(PD6) 88(PD7); IC?#13 1(PE2) 2(PE3) 3(PE4) 4(PE5) 5(PE6) 38(PE7) 39(PE8) 40(PE9) 41(PE10) 42(PE11) 43(PE12) 44(PE13) 45(PE14) 46(PE15) 97(PE0) 98(PE1); IC?#14 6(VBAT) 10(VSS) 11(VDD) 12(PH0) 13(PH1) 14(NRST) 19(VDD) 20(VSSA) 21(VREF+) 22(VDDA) 27(VSS) 28(VDD) 49(VCAP_1) 50(VDD) 73(VCAP_2) 74(VSS) 75(VDD) 94(BOOT0) 99(VSS) 100(VDD)

### Library data of the parts
IC?#9-IC?#14 = STM, STM32F417VxTx: IC, MCU, STM32F417, QFP-100; ComponentLink1Description: Datasheet; ComponentLink1URL: E:\Altium\Datasheets\IC - MCU\STM, STM32F415xx, STM32F417xx.pdf; ComponentLink2Description: Supplier Link; ComponentLink2URL: https://www.digikey.com/en/products/detail/stmicroelectronics/STM32F417VGT6/2757684; Supplier: Digikey; Supplier Part Number: 497-11900-ND; Manufacturer: STM; Operating Temperature, Min: -40℃; Operating Temperature, Max: +85℃; Quantity, Min: 1; Quantity, Max: 450; Price, Min: 19.05; Supplier Currency: $; Price, Max: 13.22667; Supplier Link: https://www.digikey.com/en/products/detail/stmicroelectronics/STM32F417VGT6/2757684; Component Type: MCU; Component Category: IC
  IC?#9: ComponentLink3Description: Programming Manual; ComponentLink3URL: E:\Altium\Datasheets\IC - MCU\STM, STM32 Cortex -M4 MCUs and MPUs programming manual.pdf

## Sheet IC - Power - DC-DC.SchDoc
size A4; SheetNumber: 33; SheetTotal: 41
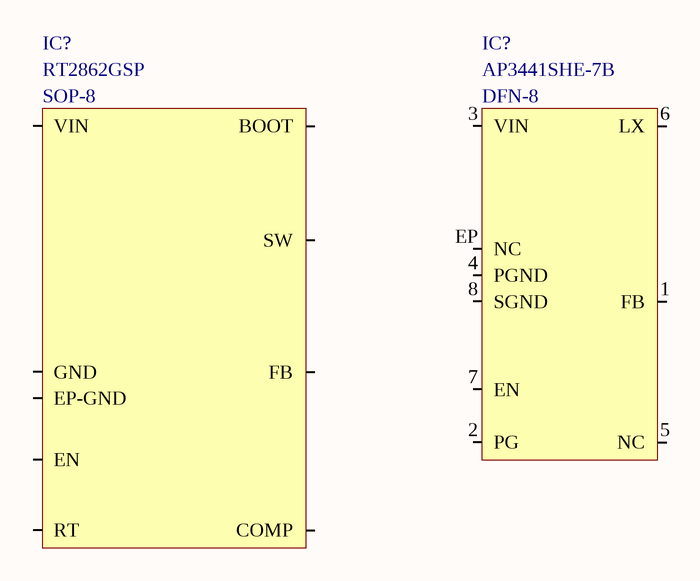
[diagram p73: IC - Power - DC-DC.SchDoc]

### Parts
(Parts that share a designator on the sheet are numbered #1, #2 ... from top to bottom, then left to right.)
IC?#15  Manufacturer Part Number: RT2862GSP  Package: SOP-8  [Richtek, RT2862xSP, SOP-8]  (hidden comment: Richtek, RT2862xSP)
IC?#16  Manufacturer Part Number: AP3441SHE-7B  Package: DFN-8  [DFN-8, 2mm x 2mm, 0.5mm]  (hidden comment: Diodes, AP3441)

### Nets

Not connected (* = marked no-connect by the designer): IC?#15 1-SW(SW) 2-BOOT(BOOT) 3-EN(EN) 4-GND(GND) 5-FB(FB) 6-COMP(COMP) 7-RT(RT) 8-VIN(VIN) EP-GND; IC?#16 1(FB) 2(PG) 3(VIN) 4(PGND) 5(NC) 6(LX) 7(EN) 8(SGND) EP(NC)

### Library data of the parts
IC?#15 = Richtek, RT2862xSP: IC, Power, Buck, SOP-8; ComponentLink1Description: Datasheet; ComponentLink1URL: E:\Altium\Datasheets\IC - Power - DC-DC\Richtek, RT2862.pdf; ComponentLink2Description: Supplier Link; ComponentLink2URL: https://www.digikey.com/en/products/detail/richtek-usa-inc/RT2862GSP/5880463; Supplier: Digikey; Supplier Part Number: 1028-1373-1-ND; Manufacturer: Richtek; Operating Temperature, Min: -40℃; Operating Temperature, Max: +85℃; Quantity, Min: 1; Quantity, Max: 5000; Price, Min: 1.93; Supplier Currency: $; Price, Max: 0.85214; Supplier Link: https://www.digikey.com/en/products/detail/richtek-usa-inc/RT2862GSP/5880463; Component Type: Power; Component Category: IC
IC?#16 = Diodes, AP3441: IC, Power, Buck, DFN-8, 2x2; Manufacturer: Richtek; ComponentLink1Description: Datasheet; ComponentLink1URL: E:\Altium\Datasheets\IC - Power - DC-DC\Diodes, AP3441.pdf; ComponentLink2Description: Supplier Link; ComponentLink2URL: https://www.digikey.com/en/products/detail/diodes-incorporated/AP3441SHE-7B/9765636; Supplier: Digikey; Supplier Part Number: AP3441SHE-7BDICT-ND; Operating Temperature, Min: -40℃; Operating Temperature, Max: +85℃; Quantity, Min: 1; Quantity, Max: 30000; Price, Min: 0.54; Supplier Currency: $; Price, Max: 0.13275; Supplier Link: https://www.digikey.com/en/products/detail/diodes-incorporated/AP3441SHE-7B/9765636; Component Type: Power; Component Category: IC

## Sheet IC - Buffer.SchDoc
size A4; SheetNumber: 28; SheetTotal: 36
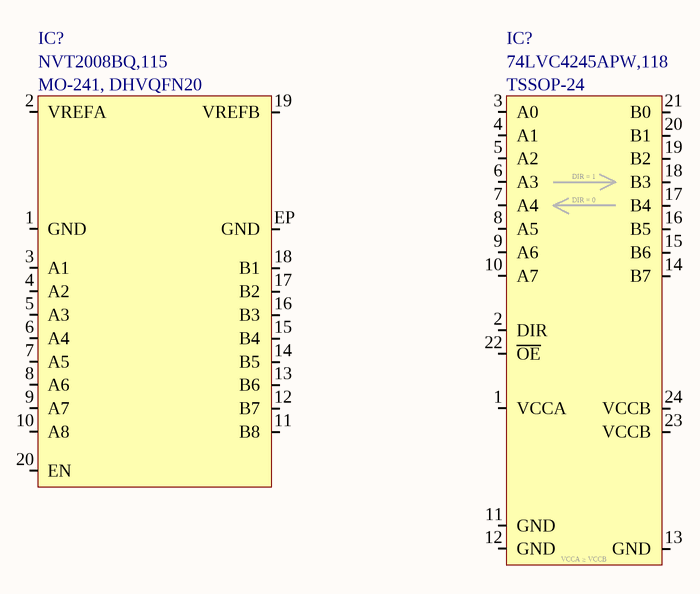
[diagram p74: IC - Buffer.SchDoc]

### Parts
(Parts that share a designator on the sheet are numbered #1, #2 ... from top to bottom, then left to right.)
IC?#17  Manufacturer Part Number: NVT2008BQ,115  [MO-241, DHVQFN20]  (hidden comment: Nexperia, NVT2008BQ)
IC?#18  Manufacturer Part Number: 74LVC4245APW,118  [TSSOP-24]  (hidden comment: Nexperia, 74LVC4245A)

### Nets

Not connected (* = marked no-connect by the designer): IC?#17 1(GND) 2(VREFA) 3(A1) 4(A2) 5(A3) 6(A4) 7(A5) 8(A6) 9(A7) 10(A8) 11(B8) 12(B7) 13(B6) 14(B5) 15(B4) 16(B3) 17(B2) 18(B1) 19(VREFB) 20(EN) EP(GND); IC?#18 1(VCCA) 2(DIR) 3(A0) 4(A1) 5(A2) 6(A3) 7(A4) 8(A5) 9(A6) 10(A7) 11(GND) 12(GND) 13(GND) 14(B7) 15(B6) 16(B5) 17(B4) 18(B3) 19(B2) 20(B1) 21(B0) 22(~{OE}) 23(VCCB) 24(VCCB)

### Notes on the sheet
- (in symbol Nexperia, 74LVC4245A) DIR = 1; DIR = 0; VCCA ≥ VCCB

### Library data of the parts
IC?#17 = Nexperia, NVT2008BQ: IC, Buffer, MO-241, DHVQFN20; ComponentLink1Description: Datasheet; ComponentLink1URL: E:\Altium\Datasheets\IC - Buffer\Nexperia, NVT2008, NVT2010.pdf; ComponentLink2Description: Supplier Link; ComponentLink2URL: https://www.digikey.com/en/products/detail/nxp-usa-inc/NVT2008BQ-115/2530654; Supplier: Digikey; Supplier Part Number: 568-5538-1-ND; Manufacturer: Nexperia; Operating Temperature, Min: -40℃; Operating Temperature, Max: +85℃; Quantity, Min: 1; Quantity, Max: 3000; Price, Min: 0.56589; Supplier Currency: $; Price, Max: 1.18; Supplier Link: https://www.digikey.com/en/products/detail/nxp-usa-inc/NVT2008BQ-115/2530654; Component Type: Buffer; Component Category: IC; Package: MO-241, DHVQFN20
IC?#18 = Nexperia, 74LVC4245A: IC, Buffer, TSSOP-24; ComponentLink1Description: Datasheet; ComponentLink1URL: E:\Altium\Datasheets\IC - Buffer\Nexperia, 74LVC4245A.pdf; ComponentLink2Description: Supplier Link; ComponentLink2URL: https://www.digikey.com/en/products/detail/nexperia-usa-inc/74LVC4245APW-118/1231659; Supplier: Digikey; Supplier Part Number: 1727-4308-1-ND; Manufacturer: Nexperia; Operating Temperature, Min: -40℃; Operating Temperature, Max: +125℃; Quantity, Min: 1; Quantity, Max: 5000; Price, Min: 0.34185; Supplier Currency: $; Price, Max: 0.91; Supplier Link: https://www.digikey.com/en/products/detail/nexperia-usa-inc/74LVC4245APW-118/1231659; Component Type: Buffer; Component Category: IC; Package: TSSOP-24

## Sheet IC - Clock, Timing, Oscillator.SchDoc
size A4; SheetNumber: 27; SheetTotal: 34
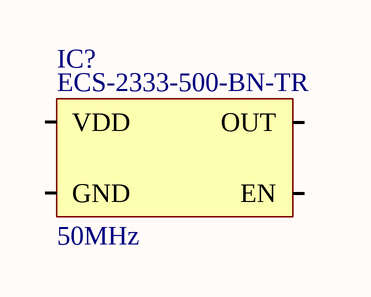
[diagram p75: IC - Clock, Timing, Oscillator.SchDoc]

### Parts
(Parts that share a designator on the sheet are numbered #1, #2 ... from top to bottom, then left to right.)
IC?#19  Frequency: 50MHz  Manufacturer Part Number: ECS-2333-500-BN-TR  [Clock Oscillator - ECS, ECS-2325, ECS-2333]  (hidden comment: Clock Oscillator - ECS, ECS-2325, ECS-2333)

### Nets

Not connected (* = marked no-connect by the designer): IC?#19 EN GND OUT VDD

### Library data of the parts
IC?#19 = Clock Oscillator - ECS, ECS-2325, ECS-2333: IC, Oscillator, 50MHz; ComponentLink1Description: Datasheet; ComponentLink1URL: E:\Altium\Datasheets\IC - Clock, Timing, Oscillator\Clock Oscillator - ECS, ECS-2325, ECS-2333.pdf; ComponentLink2Description: Supplier Link; ComponentLink2URL: https://www.digikey.com/en/products/detail/ecs-inc/ECS-2333-500-BN-TR/3927356; Supplier: Digikey; Supplier Part Number: XC1930CT-ND; Operating Temperature, Min: -40℃; Operating Temperature, Max: +85℃; Quantity, Min: 1; Quantity, Max: 10000; Price, Min: 1.24; Supplier Currency: $; Price, Max: 0.71656; Supplier Link: https://www.digikey.com/en/products/detail/ecs-inc/ECS-2333-500-BN-TR/3927356; Component Type: Clock, Timing, Oscillator; Component Category: IC; Manufacturer: ECS; Package: Flat, 3.2mm x 2.5mm

## Sheet Mechanical.SchDoc
size A3; SheetNumber: 35; SheetTotal: 41
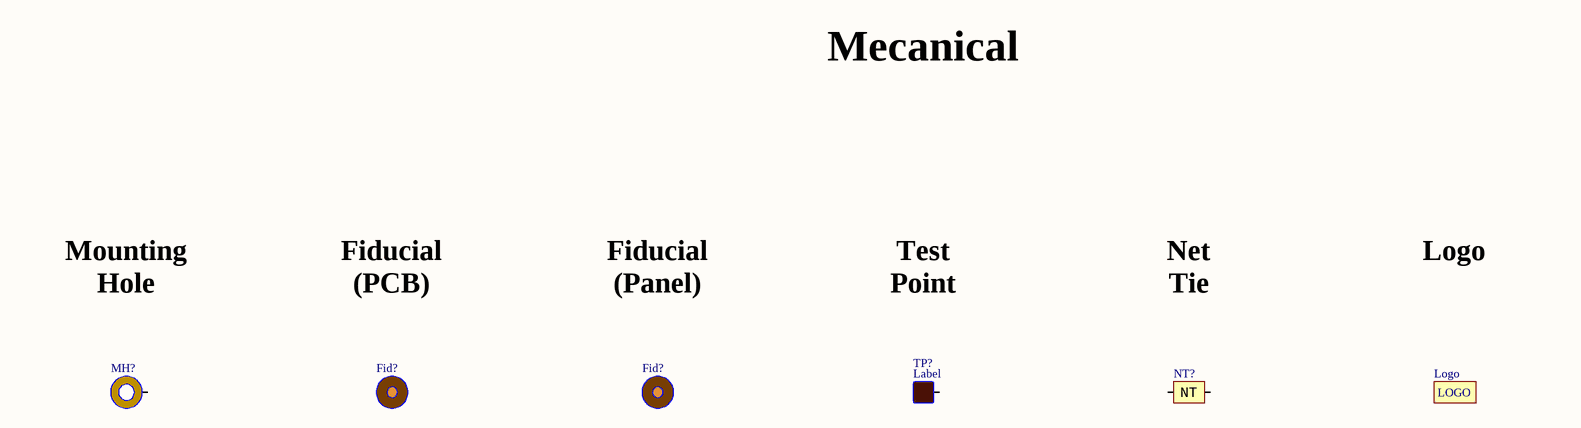
[diagram p76: Mechanical.SchDoc]

### Parts
(Parts that share a designator on the sheet are numbered #1, #2 ... from top to bottom, then left to right.)
Fid?#1  Fiducial  [Fiducial - 2mm, 5mm]  (value not drawn)  (no BOM)
Fid?#2  Fiducial  [Fiducial, Panel - 2mm, 5mm]  (value not drawn)  (no BOM)
Logo  Logo  [Logo 1]  (value not drawn)  (no BOM)
MH?  Mounting Hole  [Mounting Hole - Hole-3.2mm, Pad-5mm]  (value not drawn)  (no BOM)
NT?  Net Tie  [Net Tie - 1mm]  (value not drawn)  (no BOM)
TP?  Test Point  [Test Point - SMD, Circular, Diameter-1mm]  (value not drawn)  (no BOM)

### Nets

Not connected (* = marked no-connect by the designer): MH? Hole; NT? 1 2; TP? TP

### Notes on the sheet
- Mecanical
- Mounting
  Hole
- Fiducial
  (PCB)
- Fiducial
  (Panel)
- Test
  Point
- Net
  Tie
- Logo
- (in symbol Logo) LOGO
- (in symbol Net Tie) NT

### Library data of the parts
Fid?#1 = Fiducial: Mechanical, Fiducial, PCB, 2mm/5mm; Component Type: Fiducial; Component Category: Mechanical
Fid?#2 = Fiducial: Mechanical, Fiducial, Panel, 2mm/5mm; Component Type: Fiducial; Component Category: Mechanical
Logo = Logo: Mechanical, Logo; Component Type: Logo; Component Category: Mechanical
MH? = Mounting Hole: Mechanical, Mounting Hole; Component Type: Mounting Hole; Component Category: Mechanical
NT? = Net Tie: Mechanical, Net Tie, 1mm; Component Type: Test Point; Component Category: Mechanical; ComponentLink1Description: Datasheet; ComponentLink1URL: E:\Altium\Datasheets\Mechanical\Net Ties and How to Use Them.pdf
TP? = Test Point: Mechanical, Test Point, Circular, 1mm; Component Type: Test Point; Component Category: Mechanical; Label: Label

## Sheet Transistor - Mosfet.SchDoc
size A3; SheetNumber: 38; SheetTotal: 38
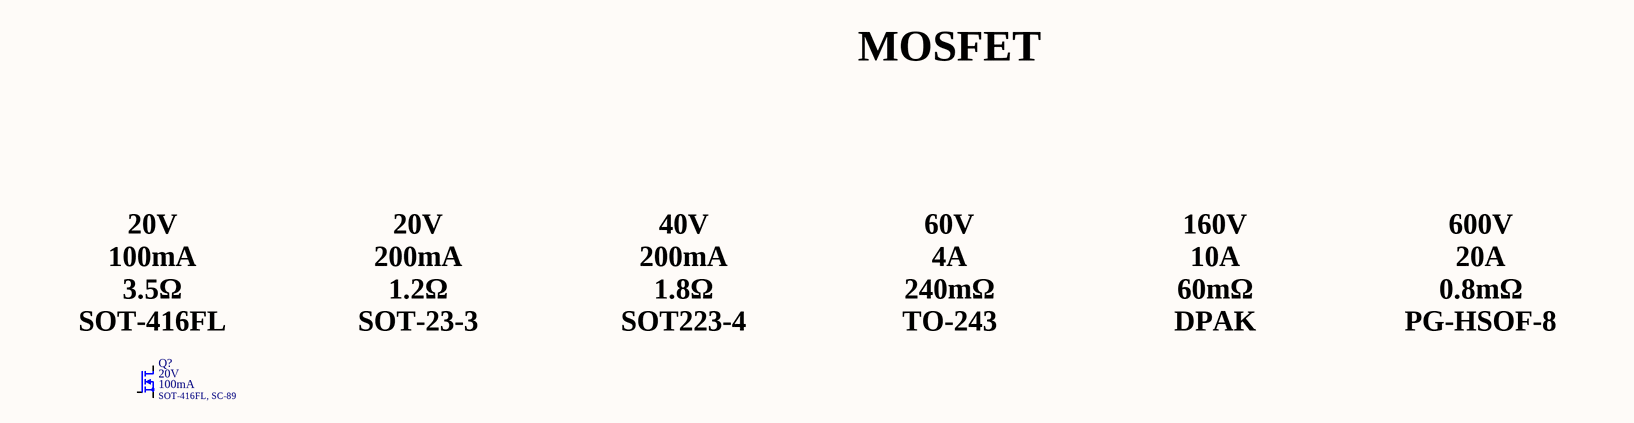
[diagram p77: Transistor - Mosfet.SchDoc]

### Parts
Q?  Current: 100mA  Voltage: 20V  Package: SOT-416FL, SC-89  [SOT-416FL, Mosfet - Type 1]  (hidden comment: Mosfet, N-Channel)

### Nets

Not connected (* = marked no-connect by the designer): Q? D G S

### Notes on the sheet
- MOSFET
- (near Q?) 20V
  100mA
  3.5Ω
  SOT-416FL
- 20V
  200mA
  1.2Ω
  SOT-23-3
- 40V
  200mA
  1.8Ω
  SOT223-4
- 60V
  4A
  240mΩ
  TO-243
- 160V
  10A
  60mΩ
  DPAK
- 600V
  20A
  0.8mΩ
  PG-HSOF-8

### Library data of the parts
Q? = Mosfet, N-Channel: MOSFET, N-CH, 20V, 100mA, SOT-416FL; Manufacturer Part Number: RE1C001UNTCL; Manufacturer: Rohm; Component Category: Transistor; ComponentLink1Description: Datasheet; ComponentLink1URL: E:\Altium\Datasheets\Transistor\Rohm, RE1C001UN.pdf; ComponentLink2Description: Supplier Link; ComponentLink2URL: https://www.digikey.com/en/products/detail/rohm-semiconductor/RE1C001UNTCL/4004557; Supplier: Digikey; Supplier Part Number: RE1C001UNTCLCT-ND; Operating Temperature, Min: *℃; Operating Temperature, Max: *℃; Quantity, Min: 1; Quantity, Max: 6000; Price, Min: 0.42; Price, Max: 0.0638; Supplier Currency: $; Supplier Link: https://www.digikey.com/en/products/detail/rohm-semiconductor/RE1C001UNTCL/4004557; Component Type: Mosfet

## Sheet Inductor.SchDoc
size A3; SheetNumber: 27; SheetTotal: 28
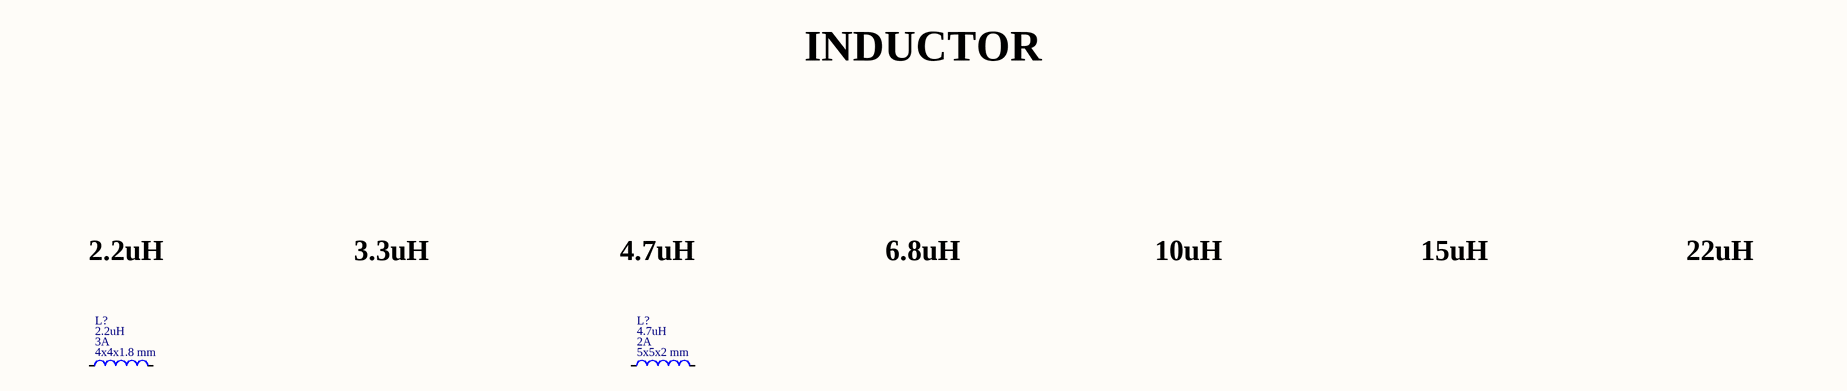
[diagram p78: Inductor.SchDoc]

### Parts
(Parts that share a designator on the sheet are numbered #1, #2 ... from top to bottom, then left to right.)
L?#1  value 2.2uH  Saturation Current: 3A  Package: 4x4x1.8 mm  [Taiyo Yuden - Power Inductor, 4040TK]  (hidden comment: Inductor)
L?#2  value 4.7uH  Saturation Current: 2A  Package: 5x5x2 mm  [Taiyo Yuden - Power Inductor, 5050WK]  (hidden comment: Inductor)

### Nets

Not connected (* = marked no-connect by the designer): L?#1 1 2; L?#2 1 2

### Notes on the sheet
- INDUCTOR
- 2.2uH
- 3.3uH
- 4.7uH
- 6.8uH
- 10uH
- 15uH
- 22uH

### Library data of the parts
L?#1 = Inductor: Inductor, Power, 2.2uH, 3A, 4x4x1.8mm; Manufacturer Part Number: NRS4018T2R2MDGJ; Manufacturer: Taiyo Yuden; ComponentLink1Description: Datasheet; ComponentLink1URL: E:\Altium\Datasheets\Inductor\Taiyo Yuden - NRx Series.pdf; ComponentLink2Description: Supplier Link; ComponentLink2URL: https://www.digikey.com/en/products/detail/taiyo-yuden/NRS4018T2R2MDGJ/2648968; Supplier: Digikey; Supplier Part Number: 587-2890-1-ND; Operating Temperature, Min: -25℃; Operating Temperature, Max: +120℃; Quantity, Min: 1; Quantity, Max: 87500; Price, Min: 0.27; Price, Max: 0.08633; Supplier Currency: $; Supplier Link: https://www.digikey.com/en/products/detail/taiyo-yuden/NRS4018T2R2MDGJ/2648968; Component Type: Power Inductor; Component Category: Inductor
L?#2 = Inductor: Inductor, Power, 4.7uH, 2A, 5x5x2mm; Manufacturer Part Number: NRS5020T4R7MMGJ; Manufacturer: Taiyo Yuden; ComponentLink1Description: Datasheet; ComponentLink1URL: E:\Altium\Datasheets\Inductor\Taiyo Yuden - NRx Series.pdf; ComponentLink2Description: Supplier Link; ComponentLink2URL: https://www.digikey.com/en/products/detail/taiyo-yuden/NRS5020T4R7MMGJ/2230192; Supplier: Digikey; Supplier Part Number: 587-2890-1-ND; Operating Temperature, Min: -25℃; Operating Temperature, Max: +125℃; Quantity, Min: 1; Quantity, Max: 20000; Price, Min: 0.31; Price, Max: 0.1079; Supplier Currency: $; Supplier Link: https://www.digikey.com/en/products/detail/taiyo-yuden/NRS5020T4R7MMGJ/2230192; Component Type: Power Inductor; Component Category: Inductor